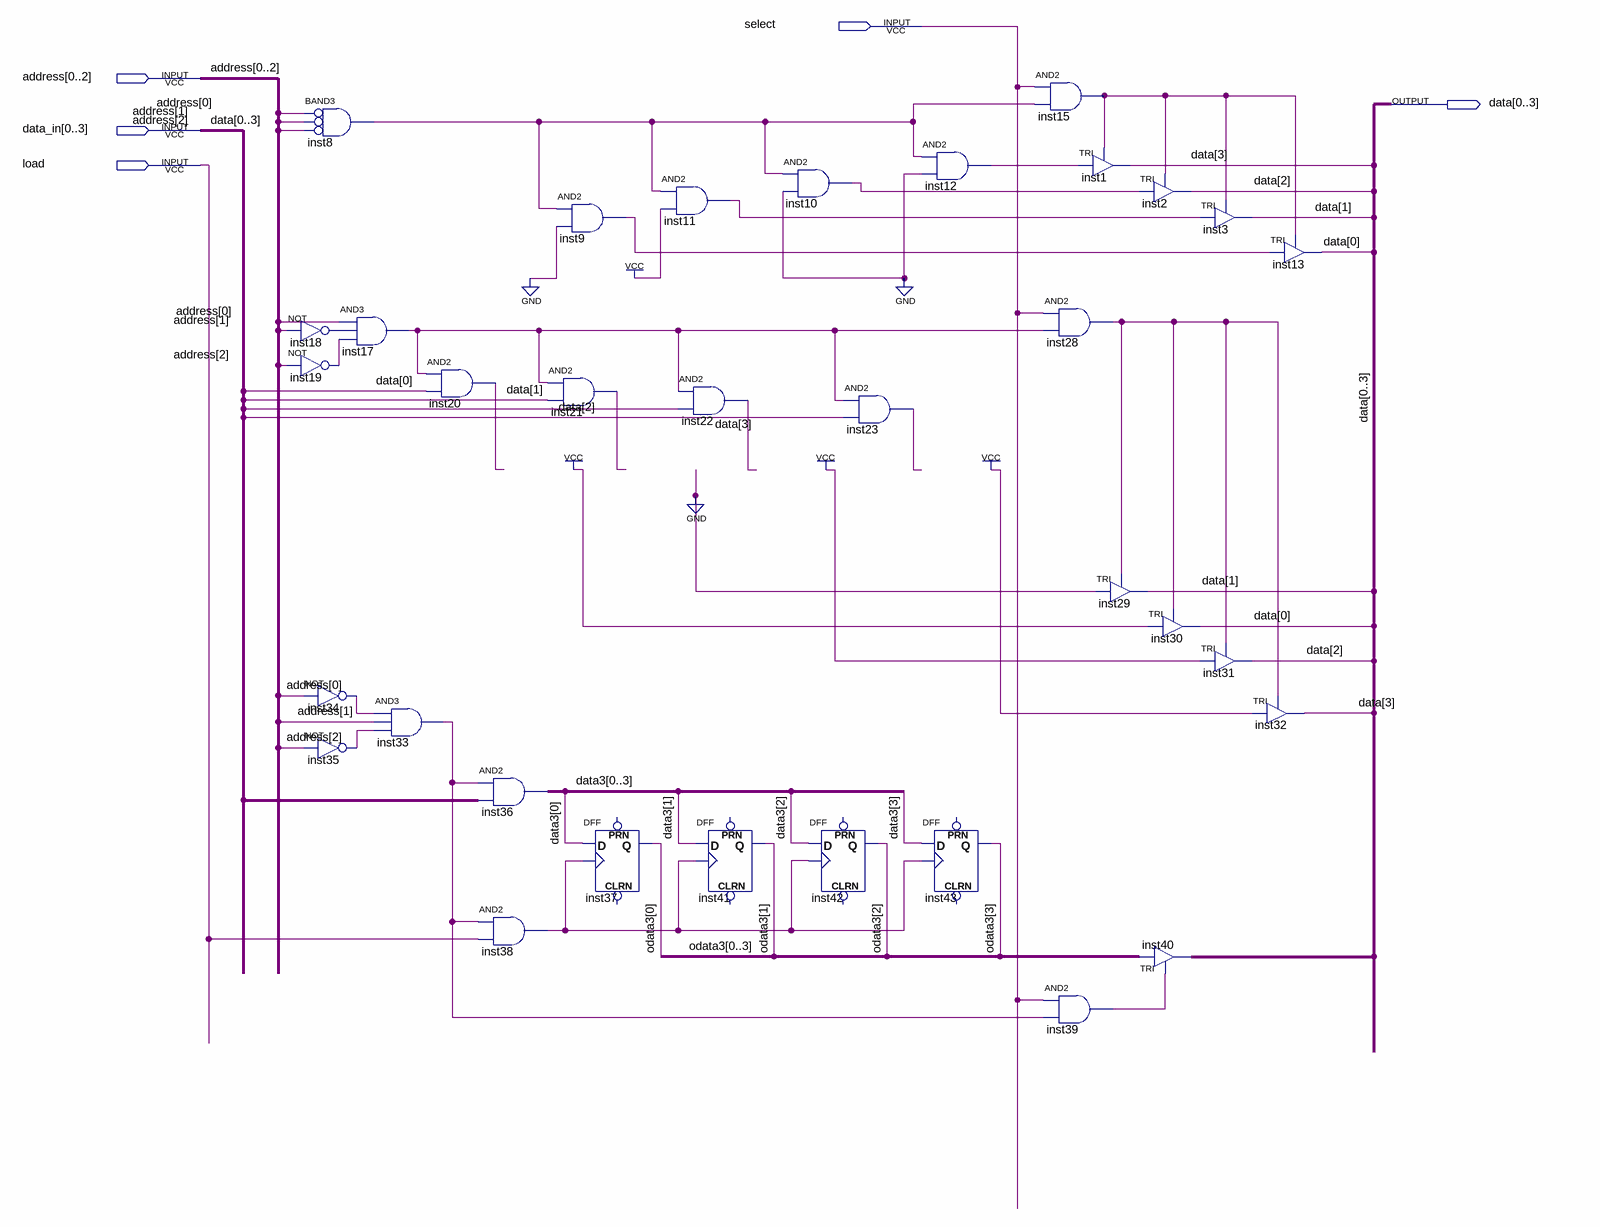
[diagram p0: schematic sheet]
// Quartus schematic data_mem2.bdf as structural Verilog: 33 symbols, 5 pins
module data_mem2 (
  input  select,
  input  [0:2] address,
  input  [0:3] data_in,
  input  load,
  output [0:3] data
);

  wire inst8_out, inst9_out, inst10_out, inst11_out, inst12_out, inst15_out, inst17_out, inst18_out,
       inst19_out, inst20_out, inst21_out, inst22_out, inst23_out, inst28_out, inst33_out, inst34_out,
       inst35_out, inst38_out, inst39_out;
  wire [3:0] data3, odata3;

  and inst8 (inst8_out, ~address[0], ~address[1], ~address[2]);  // BAND3
  and inst17 (inst17_out, address[0], inst18_out, inst19_out);
  not inst18 (inst18_out, address[1]);
  not inst19 (inst19_out, address[2]);
  not inst34 (inst34_out, address[0]);
  not inst35 (inst35_out, address[2]);
  and inst33 (inst33_out, inst34_out, address[1], inst35_out);
  and inst20 (inst20_out, inst17_out, data_in[0]);
  assign {data3[0], data3[1], data3[2], data3[3]} = {4{inst33_out}} & data_in;  // AND2 inst36, 4 bits wide
  and inst38 (inst38_out, inst33_out, load);
  and inst9 (inst9_out, inst8_out, 1'b0);
  and inst21 (inst21_out, inst17_out, data_in[1]);
  DFF inst37 (.CLK(inst38_out), .D(data3[0]), .Q(odata3[0]));  // open: CLRN, PRN
  and inst11 (inst11_out, inst8_out, 1'b1);
  and inst22 (inst22_out, inst17_out, data_in[2]);
  DFF inst41 (.CLK(inst38_out), .D(data3[1]), .Q(odata3[1]));  // open: CLRN, PRN
  and inst10 (inst10_out, inst8_out, 1'b0);
  DFF inst42 (.CLK(inst38_out), .D(data3[2]), .Q(odata3[2]));  // open: CLRN, PRN
  and inst23 (inst23_out, inst17_out, data_in[3]);
  and inst12 (inst12_out, inst8_out, 1'b0);
  DFF inst43 (.CLK(inst38_out), .D(data3[3]), .Q(odata3[3]));  // open: CLRN, PRN
  and inst15 (inst15_out, select, inst8_out);
  and inst28 (inst28_out, select, inst17_out);
  and inst39 (inst39_out, select, inst33_out);
  TRI inst1 (.IN(inst12_out), .OE(inst15_out), .OUT(data_in[3]));
  TRI inst29 (.IN(1'b0), .OE(inst28_out), .OUT(data_in[1]));
  TRI inst2 (.IN(inst10_out), .OE(inst15_out), .OUT(data_in[2]));
  TRI inst30 (.IN(1'b1), .OE(inst28_out), .OUT(data_in[0]));
  TRI inst40[3:0] (.IN({odata3[0], odata3[1], odata3[2], odata3[3]}), .OE(inst39_out), .OUT(data_in));
  TRI inst3 (.IN(inst11_out), .OE(inst15_out), .OUT(data_in[1]));
  TRI inst31 (.IN(1'b1), .OE(inst28_out), .OUT(data_in[2]));
  TRI inst32 (.IN(1'b1), .OE(inst28_out), .OUT(data_in[3]));
  TRI inst13 (.IN(inst9_out), .OE(inst15_out), .OUT(data_in[0]));

  assign data = data_in;
endmodule
